# Altium project PCB_Switch_PowerDetect.PrjPcb
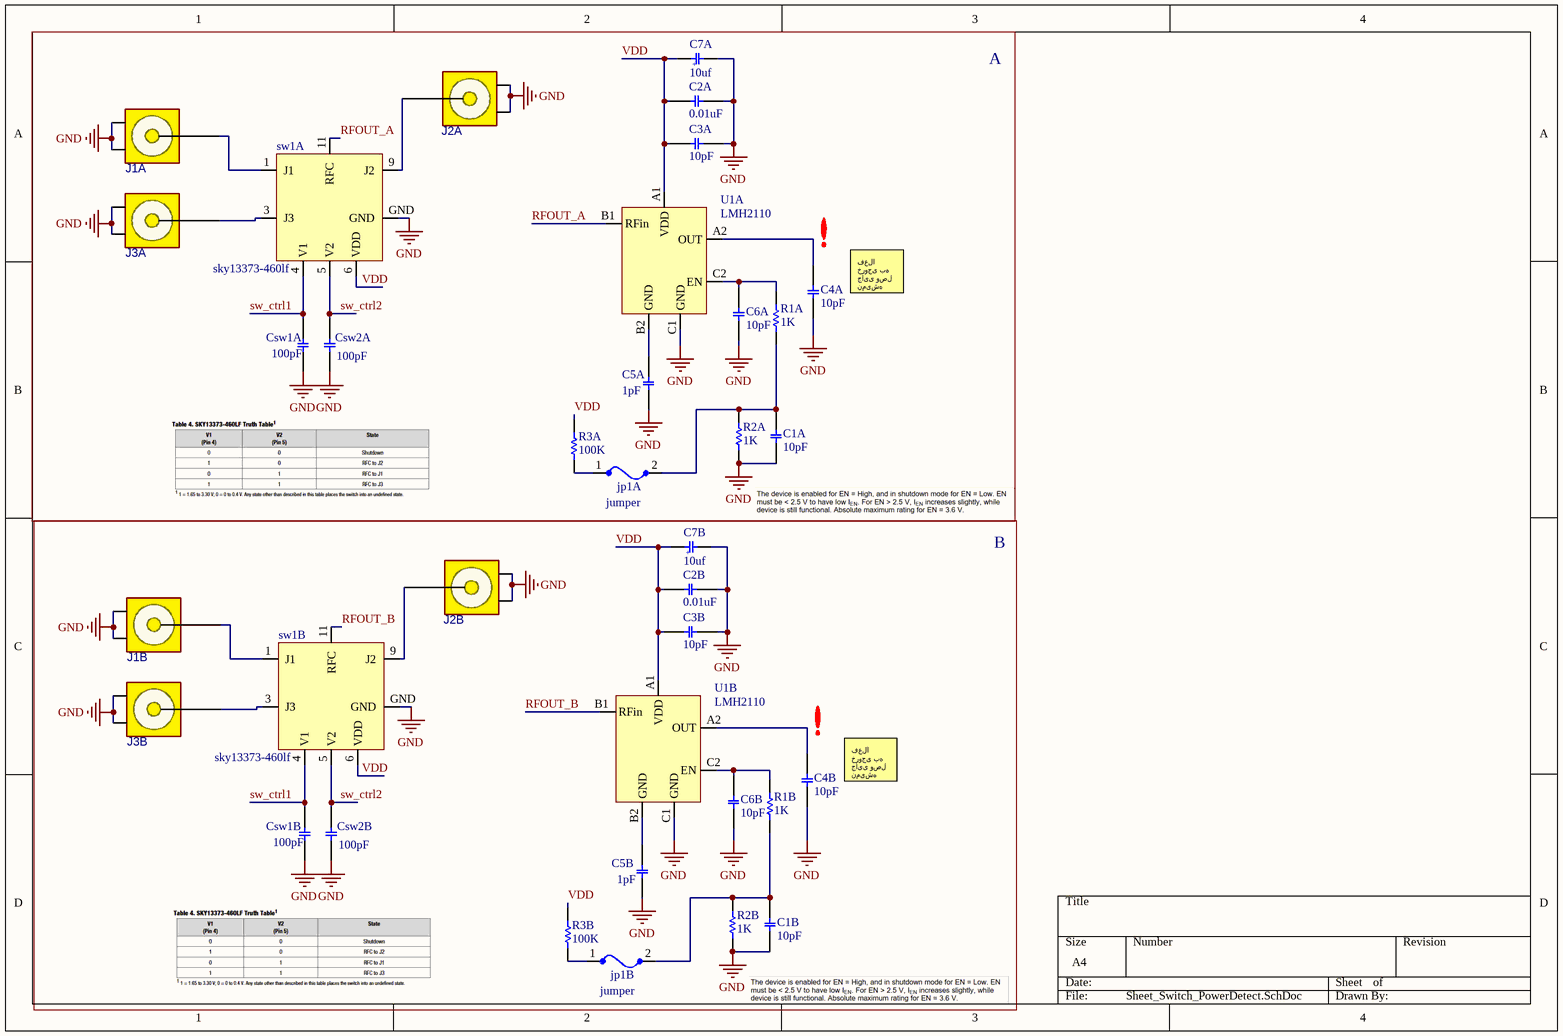
[diagram p0: Sheet_Switch_PowerDetect.SchDoc]
1 sheet, 36 parts. Net scope: global (net labels, ports and power ports of the same name join across sheets).
Board file: PCB_Switch_PowerDetect.PcbDoc

## Sheet Sheet_Switch_PowerDetect.SchDoc
size A4; DrawnBy: M.J.Khodami; Revision: 1; SheetNumber: 1; SheetTotal: 1

### Parts
C1A  value 10pF  [C0402]  (hidden comment: Capacitor C SMD 0402)
C1B  value 10pF  [C0402]  (hidden comment: Capacitor C SMD 0402)
C2A  value 0.01uF  [C0402]  (hidden comment: Capacitor C SMD 0402)
C2B  value 0.01uF  [C0402]  (hidden comment: Capacitor C SMD 0402)
C3A  value 10pF  [C0402]  (hidden comment: Capacitor C SMD 0402)
C3B  value 10pF  [C0402]  (hidden comment: Capacitor C SMD 0402)
C4A  value 10pF  [C0402]  (hidden comment: Capacitor C SMD 0402)
C4B  value 10pF  [C0402]  (hidden comment: Capacitor C SMD 0402)
C5A  value 1pF  [C0402]  (hidden comment: Capacitor C SMD 0402)
C5B  value 1pF  [C0402]  (hidden comment: Capacitor C SMD 0402)
C6A  value 10pF  [C0402]  (hidden comment: Capacitor C SMD 0402)
C6B  value 10pF  [C0402]  (hidden comment: Capacitor C SMD 0402)
C7A  value 10uf  [CAPP 1206 (3216X18L) Size A]  (hidden comment: Capacitor Tantalum SMD)
C7B  value 10uf  [CAPP 1206 (3216X18L) Size A]  (hidden comment: Capacitor Tantalum SMD)
Csw1A  value 100pF  [C0402]  (hidden comment: Capacitor C SMD 0402)
Csw1B  value 100pF  [C0402]  (hidden comment: Capacitor C SMD 0402)
Csw2A  value 100pF  [C0402]  (hidden comment: Capacitor C SMD 0402)
Csw2B  value 100pF  [C0402]  (hidden comment: Capacitor C SMD 0402)
J1A  UFL  [UFL]  (value not drawn)
J1B  UFL  [UFL]  (value not drawn)
J2A  UFL  [UFL]  (value not drawn)
J2B  UFL  [UFL]  (value not drawn)
J3A  UFL  [UFL]  (value not drawn)
J3B  UFL  [UFL]  (value not drawn)
jp1A  jumper  [RES 0402 (1005X04L)]
jp1B  jumper  [RES 0402 (1005X04L)]
R1A  value 1K  [SMD-0402-RES]  (hidden comment: Resistor SMD 0402)
R1B  value 1K  [SMD-0402-RES]  (hidden comment: Resistor SMD 0402)
R2A  value 1K  [SMD-0402-RES]  (hidden comment: Resistor SMD 0402)
R2B  value 1K  [SMD-0402-RES]  (hidden comment: Resistor SMD 0402)
R3A  value 100K  [SMD-0402-RES]  (hidden comment: Resistor SMD 0402)
R3B  value 100K  [SMD-0402-RES]  (hidden comment: Resistor SMD 0402)
sw1A  sky13373-460lf  [QFN50P200X200X65-13N]
sw1B  sky13373-460lf  [QFN50P200X200X65-13N]
U1A  LMH2110  [BGA6N40P3X2_124X84X67N]
U1B  LMH2110  [BGA6N40P3X2_124X84X67N]

### Blocks framed on the sheet
A: C1A C2A C3A C4A C5A C6A C7A Csw1A Csw2A J1A J2A J3A jp1A R1A R2A R3A sw1A U1A
B: C1B C2B C3B C4B C5B C6B C7B Csw1B Csw2B J1B J2B J3B jp1B R1B R2B R3B sw1B U1B

### Nets
GND: C1A.1 C1B.1 C2A.2 C2B.2 C3A.2 C3B.2 C4A.1 C4B.1 C5A.1 C5B.1 C6A.1 C6B.1 C7A.1 C7B.1 Csw1A.1 Csw1B.1 Csw2A.1 Csw2B.1 J1A.2(G1) J1A.3(G2) J1B.2(G1) J1B.3(G2) J2A.2(G1) J2A.3(G2) J2B.2(G1) J2B.3(G2) J3A.2(G1) J3A.3(G2) J3B.2(G1) J3B.3(G2) R2A.1 R2B.1 sw1A.GND sw1B.GND U1A.C1(GND) U1B.C1(GND)
RFOUT_A: sw1A.11(RFC) U1A.B1(RFin)
RFOUT_B: sw1B.11(RFC) U1B.B1(RFin)
sw_ctrl1: Csw1A.2 Csw1B.2 sw1A.4(V1) sw1B.4(V1)
sw_ctrl2: Csw2A.2 Csw2B.2 sw1A.5(V2) sw1B.5(V2)
VDD: C2A.1 C2B.1 C3A.1 C3B.1 C7A.2 C7B.2 R3A.2 R3B.2 sw1A.6(VDD) sw1B.6(VDD) U1A.A1(VDD) U1B.A1(VDD)
NetC1A_2: C1A.2 jp1A.2 R1A.1 R2A.2
NetC1B_2: C1B.2 jp1B.2 R1B.1 R2B.2
NetC4A_2: C4A.2 U1A.A2(OUT)
NetC4B_2: C4B.2 U1B.A2(OUT)
NetC5A_2: C5A.2 U1A.B2(GND)
NetC5B_2: C5B.2 U1B.B2(GND)
NetC6A_2: C6A.2 R1A.2 U1A.C2(EN)
NetC6B_2: C6B.2 R1B.2 U1B.C2(EN)
NetJ1A_1: J1A.1(SIG) sw1A.1(J1)
NetJ1B_1: J1B.1(SIG) sw1B.1(J1)
NetJ2A_1: J2A.1(SIG) sw1A.9(J2)
NetJ2B_1: J2B.1(SIG) sw1B.9(J2)
NetJ3A_1: J3A.1(SIG) sw1A.3(J3)
NetJ3B_1: J3B.1(SIG) sw1B.3(J3)
Netjp1A_1: jp1A.1 R3A.1
Netjp1B_1: jp1B.1 R3B.1

### Notes on the sheet
- (near C4A) فعلا خروجی به جایی وصل نمیشه
- (near C4B) فعلا خروجی به جایی وصل نمیشه
- (in symbol Capacitor Tantalum SMD) +

### Library data of the parts
C1A C1B C2A C2B C3A C3B C4A C4B C5A C5B C6A C6B Csw1A Csw1B Csw2A Csw2B = Capacitor C SMD 0402: Designed by:: MJKhodami
C7A C7B = Capacitor Tantalum SMD: Designed by:: MJKhodami
J1A J1B J2A J2B J3A J3B = RF UFL: CONN, RF, U.FL, STRAIGHT, Ultra Miniature Coaxial; Designed by:: MJKhodami; ComponentLink1Description: Our Website:; ComponentLink1URL: https://www.spaceomid.com/
R1A R1B R2A R2B R3A R3B = Resistor SMD 0402: Designed by:: MJKhodami
sw1A sw1B = sky13373-460lf: Broadband frequency range: 0.1 to 8.0 GHz / • Low insertion loss: 0.45 dB @ 2.5 GHz, 0.65 dB @ 7.125 GHz / • High isolation: 30 dB up to 2.5 GHz / • No external DC blocking capacitors required / • Positive low voltage control: VCTL = 1.65 to 3.00 V, / VDD = 2.5 to 4.8 V / • Small, QFN (12-pin, 2 x 2 mm) package / (MSL1, 260 °C per JEDEC J-STD-020)
U1A U1B = LMH2110: - Wide Supply Range from 2.7 V to 5 V / - Logarithmic Root Mean Square Response